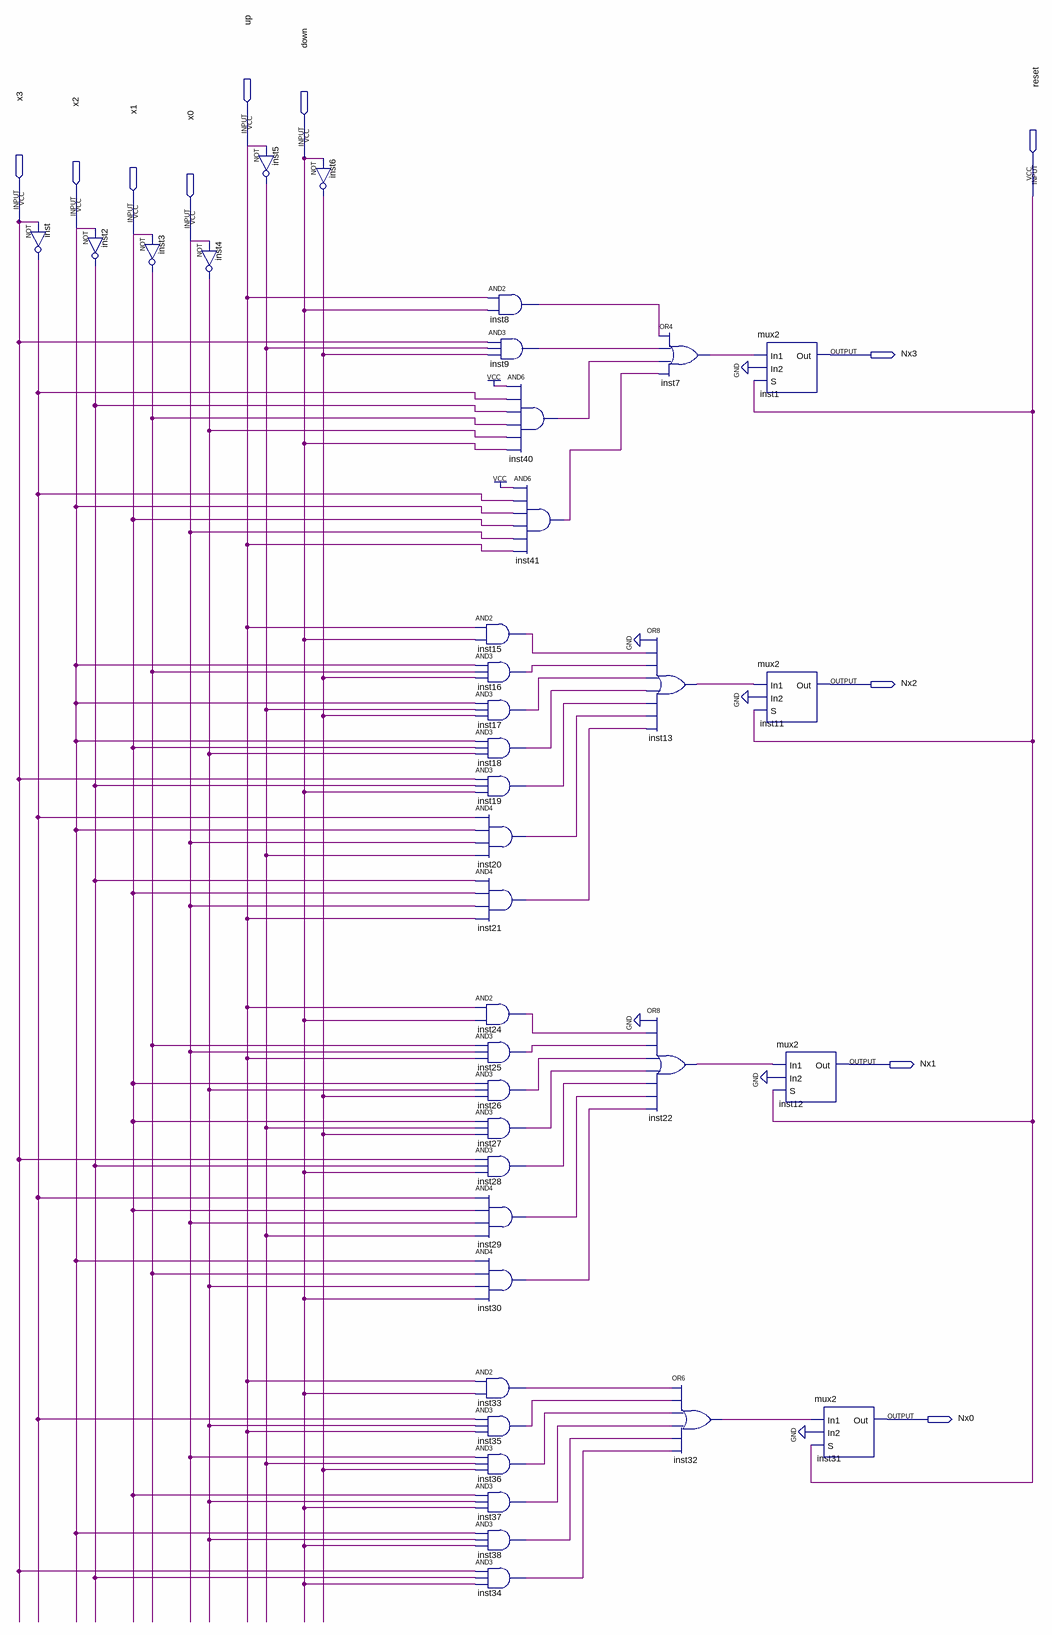
[diagram p0: schematic sheet]
// Quartus schematic Input.bdf as structural Verilog: 38 symbols, 11 pins
module Input (
  input  up,
  input  down,
  input  reset,
  input  x3,
  input  x2,
  input  x1,
  input  x0,
  output Nx3,
  output Nx2,
  output Nx1,
  output Nx0
);

  wire inst2_out, inst3_out, inst4_out, inst5_out, inst6_out, inst7_out, inst8_out, inst9_out, inst13_out,
       inst15_out, inst16_out, inst17_out, inst18_out, inst19_out, inst20_out, inst21_out, inst22_out,
       inst24_out, inst25_out, inst26_out, inst27_out, inst28_out, inst29_out, inst30_out, inst32_out,
       inst33_out, inst34_out, inst35_out, inst36_out, inst37_out, inst38_out, inst40_out, inst41_out,
       inst_out;

  not inst (inst_out, x3);
  not inst2 (inst2_out, x2);
  not inst3 (inst3_out, x1);
  not inst4 (inst4_out, x0);
  not inst5 (inst5_out, up);
  not inst6 (inst6_out, down);
  and inst8 (inst8_out, up, down);
  and inst9 (inst9_out, x3, inst5_out, inst6_out);
  and inst40 (inst40_out, 1'b1, inst_out, inst2_out, inst3_out, inst4_out, down);
  and inst41 (inst41_out, 1'b1, inst_out, x2, x1, x0, up);
  and inst15 (inst15_out, up, down);
  and inst16 (inst16_out, x2, inst3_out, inst6_out);
  and inst17 (inst17_out, x2, inst5_out, inst6_out);
  and inst18 (inst18_out, x2, x1, inst4_out);
  and inst19 (inst19_out, x3, inst2_out, down);
  and inst20 (inst20_out, inst_out, x2, x0, inst5_out);
  and inst21 (inst21_out, inst2_out, x1, x0, up);
  and inst24 (inst24_out, up, down);
  and inst25 (inst25_out, inst3_out, x0, up);
  and inst26 (inst26_out, x1, inst4_out, inst6_out);
  and inst27 (inst27_out, x1, inst5_out, inst6_out);
  and inst28 (inst28_out, x3, inst2_out, down);
  and inst29 (inst29_out, inst_out, x1, x0, inst5_out);
  and inst30 (inst30_out, x2, inst3_out, inst4_out, down);
  and inst33 (inst33_out, up, down);
  and inst35 (inst35_out, inst_out, inst4_out, up);
  and inst36 (inst36_out, x0, inst5_out, inst6_out);
  and inst37 (inst37_out, x1, inst4_out, down);
  and inst38 (inst38_out, x2, inst4_out, down);
  and inst34 (inst34_out, x3, inst2_out, down);
  or inst7 (inst7_out, inst8_out, inst9_out, inst40_out, inst41_out);
  or inst13 (inst13_out, 1'b0, inst15_out, inst16_out, inst17_out, inst18_out, inst19_out, inst20_out, inst21_out);
  or inst22 (inst22_out, 1'b0, inst24_out, inst25_out, inst26_out, inst27_out, inst28_out, inst29_out, inst30_out);
  or inst32 (inst32_out, inst33_out, inst35_out, inst36_out, inst37_out, inst38_out, inst34_out);
  mux2 inst1 (.In1(inst7_out), .In2(1'b0), .S(reset), .Out(Nx3));
  mux2 inst11 (.In1(inst13_out), .In2(1'b0), .S(reset), .Out(Nx2));
  mux2 inst12 (.In1(inst22_out), .In2(1'b0), .S(reset), .Out(Nx1));
  mux2 inst31 (.In1(inst32_out), .In2(1'b0), .S(reset), .Out(Nx0));
endmodule
